# EAGLE design tweeq-extMod_I2C_Adapter v2 (EAGLE 6.4)
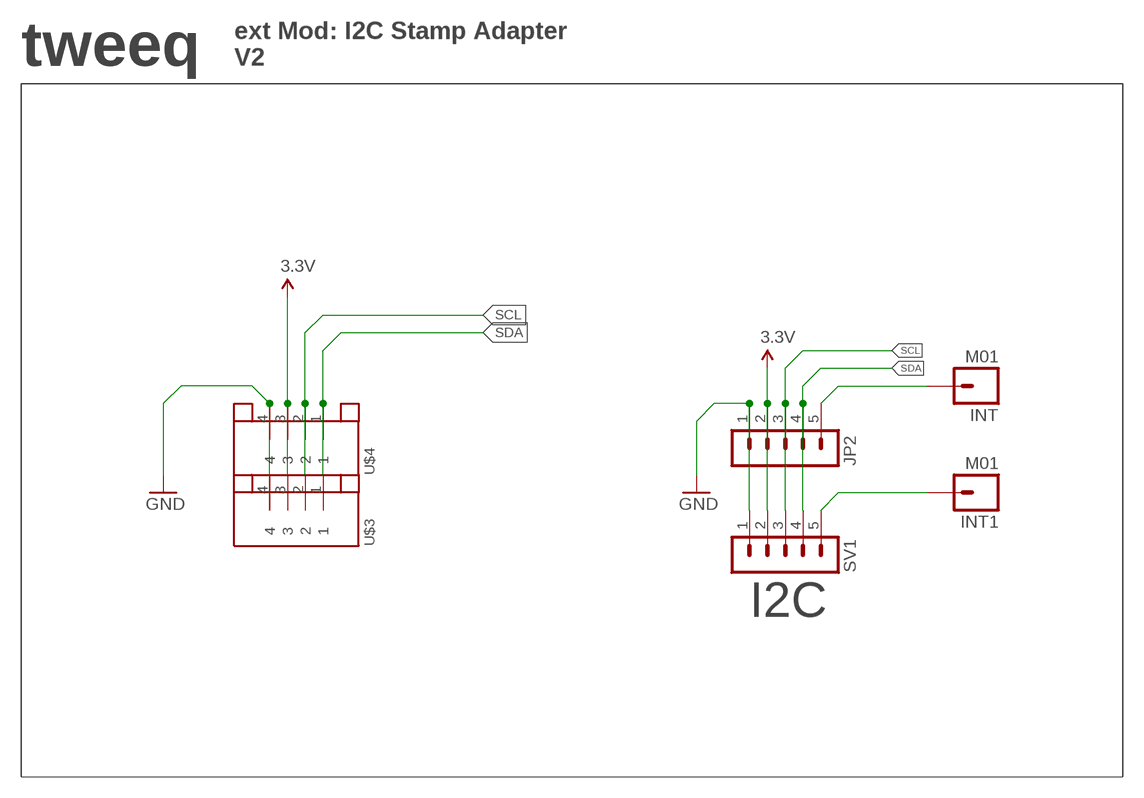
[diagram p0: schematic, sheet 1]

## Parts
INT  M01  [AISCUBE_1X01_TIGHTFITVIA]
INT1  M01  [AISCUBE_1X01_TIGHTFITVIA]
JP2  M05-11.5MM-SMT  [1X05-1.5MM-SMT]
SV1  M05-11.5MM-SMT  [1X05-1.5MM-SMT]
U$3  JST-4PINSH  [SH1.0-4PIN]
U$4  JST-4PINSH  [SH1.0-4PIN]

## Nets
3.3V: JP2.2 SV1.2 U$3.3 U$4.3
GND: JP2.1 SV1.1 U$4.4
INT: INT.P$1 JP2.5
N$2: INT1.P$1 SV1.5
SCL: JP2.3 SV1.3 U$3.2 U$4.2
SDA: JP2.4 SV1.4 U$3.1 U$4.1
Unconnected: U$3.4

## Notes on the sheet
- tweeq
- ext Mod: I2C Stamp Adapter
  V2
- INT/RA1
- I2C

## Library data of the parts
INT INT1 = AISCube:M01: Header 1 Standard 1-pin 0.1" header.
JP2 SV1 = AISCube:M05-1: PIN HEADER Standard 0.1" header pin 5 pins - 1 way
U$3 U$4 = AISCube:JST-4PIN: JST 4 Pin

## Board
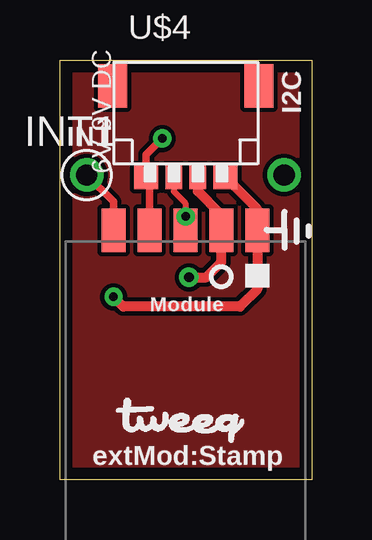
[diagram p1: board, top side]
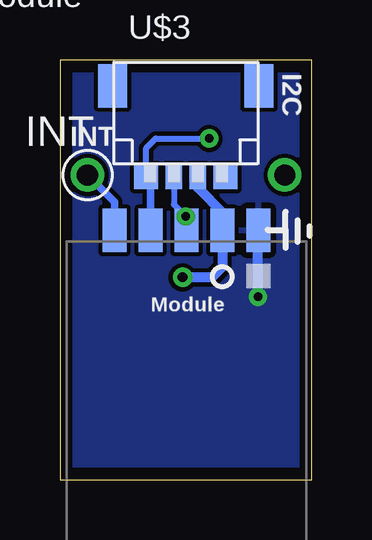
[diagram p2: board, bottom side, seen from below]

Size 10.5 x 17.5 mm. Coordinates in mm from the lower left corner, seen from the top.
Outline: 0,17.5 10.5,17.5 10.5,0 0,0 0,17.5
Copper layers (1*16): Top 0.0356mm / dielectric 1.5011mm / Bottom 0.0356mm
Design rules "AISCube": minimum track width 7mil, minimum drill 14mil, track to track 7mil, track to pad 7mil, pad to pad 7mil, via to via 7mil, smd to smd 0mil, copper to edge 20mil, drill to drill 8mil, minimum pad ring 10mil, minimum via ring 8mil, stop-mask expansion 4mil, vias tented up to drill 32mil, thermal gap 10mil

### Footprints (pad centres in the part's own frame; a part is rotated, then mirrored left to right if it is on the bottom)
AISCUBE_1X01_TIGHTFITVIA = drill 0.889: P$1 0,0
1X05-1.5MM-SMT = smd 1 x 1.8: 1 6,0.1; 2 4.5,0.1; 3 3,0.1; 4 1.5,0.1; 5 0,0.1
SH1.0-4PIN = smd 1 x 1: 1 -1.65,-0.55; 4 1.65,-0.55 | smd 0.7 x 1: 2 -0.5,-0.55; 3 0.5,-0.55 | smd 1.2 x 1.8: P$1 -3.05,3.25; P$2 3.05,3.25

### Placement (x,y rotation side)
INT  9.35,12.7 0 bottom
INT1  1.12,12.7 0 top
JP2  8.23,10.29 0 bottom
SV1  2.23,10.3 0 top
U$1  [TWEEQ-LOGO-S]  2.34,1.52 0 top
U$3  5.25,13.16 0 bottom
U$4  5.25,13.16 0 top

### Tracks (layer width: path | path; a pad name or v marks a point on that pad's centre or on a via)
3.3V  (via drill 0.41)
  Top 0.406: U$4.3 5.75,12.03 6.71,11.07 6.71,10.37 SV1.2 6.73,9.07 6.1,8.43 v5.38,8.43
  Bottom 0.406: v5.38,8.43 4.17,8.43 3.73,8.87 JP2.2 3.73,11.14 4.75,12.17 U$3.3
GND  (via drill 0.36)
  Top 0.406: v2.23,7.62 2.64,7.21 7.52,7.21 8.23,7.93 SV1.1 8.23,11.28 U$4.4
  Bottom 0.406: v2.23,7.62 JP2.1
  pour Bottom: 0.1,0.2 10.34,0.2 10.34,17.31 0.1,17.31
INT
  Bottom 0.305: JP2.5 8.23,11.58 INT.P$1
N$1
  pour Top: 0.1,0.2 10.34,0.2 10.34,17.31 0.1,17.31
N$2
  Top 0.305: SV1.5 2.23,11.58 INT1.P$1
SCL  (via drill 0.36)
  Top 0.254: 5.25,10.41 SV1.3 5.23,11.53 4.75,12.01 U$4.2
  Top 0.305: v5.25,10.97 5.25,10.41
  Bottom 0.254: U$3.2 5.75,11.47 v5.25,10.97 5.23,10.95 JP2.3
SDA  (via drill 0.36)
  Top 0.305: 3.76,10.42 SV1.4 3.73,12.48 U$4.1 3.6,13.56 v4.27,14.22
  Bottom 0.254: U$3.1 6.9,13.83 6.5,14.22 v4.27,14.22
  Bottom 0.305: JP2.4 6.73,12.44 U$3.1

### Text on the board
tPlace: I2C | INT | extMod:Stamp
bPlace: I2C | INT
tNames: 6V-9V DC | ON
bNames: Breadboard | V-Reg | Module